# EAGLE schematic WattMeter_v2 (EAGLE 6.5.0)
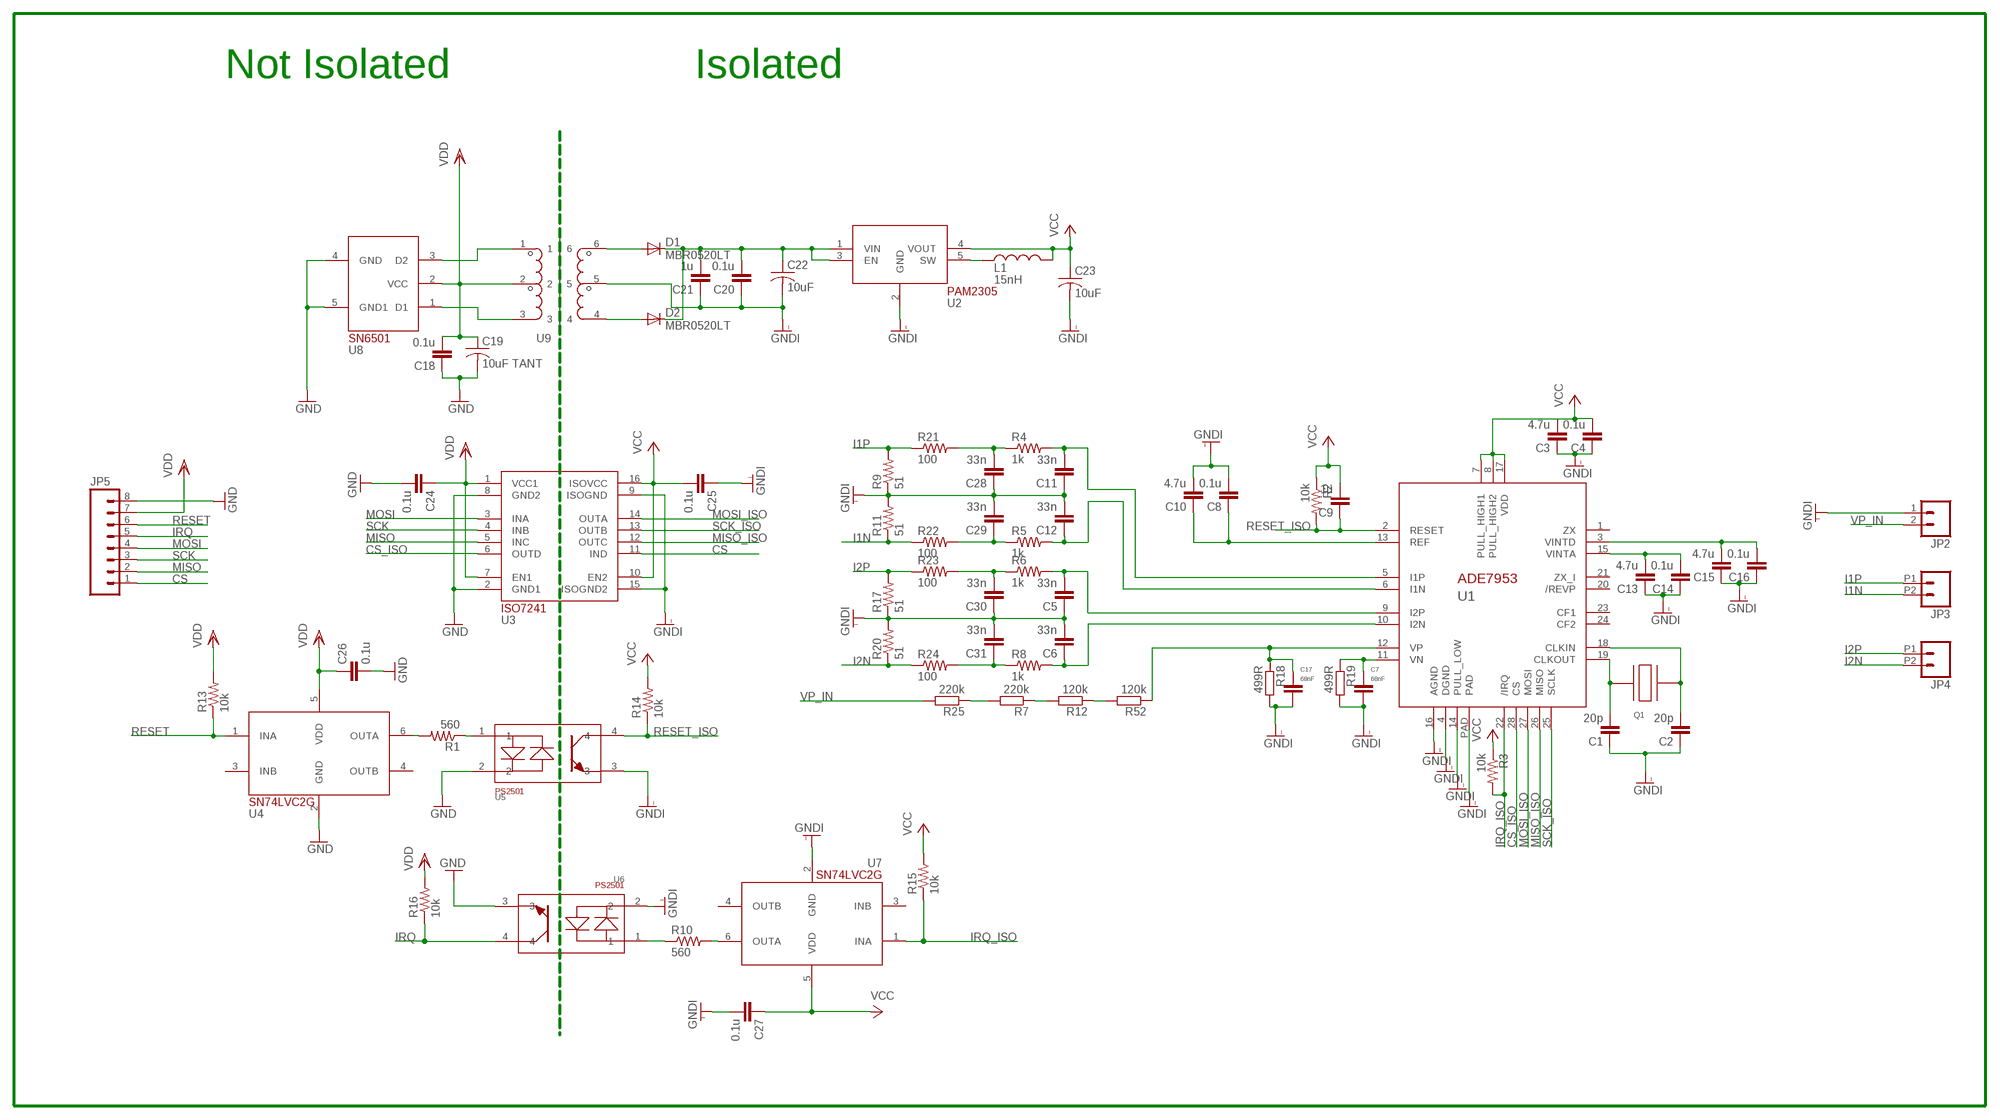
[diagram p0: schematic, sheet 1]

## Parts
C1  20p  0402-CAP  [0402-CAP]
C2  20p  0402-CAP  [0402-CAP]
C3  4.7u  0402-CAP  [0402-CAP]
C4  0.1u  0402-CAP  [0402-CAP]
C5  33n  0402-CAP  [0402-CAP]
C6  33n  0402-CAP  [0402-CAP]
C7  68nF  C-EUC0805K  [C0805K]
C8  0.1u  0402-CAP  [0402-CAP]
C9  1u  0402-CAP  [0402-CAP]
C10  4.7u  0402-CAP  [0402-CAP]
C11  33n  0402-CAP  [0402-CAP]
C12  33n  0402-CAP  [0402-CAP]
C13  4.7u  0402-CAP  [0402-CAP]
C14  0.1u  0402-CAP  [0402-CAP]
C15  4.7u  0402-CAP  [0402-CAP]
C16  0.1u  0402-CAP  [0402-CAP]
C17  68nF  C-EUC0805K  [C0805K]
C18  0.1u  0402-CAP  [0402-CAP]
C19  10uF TANT  C-USC0603  [C0603]
C20  0.1u  0402-CAP  [0402-CAP]
C21  1u  0402-CAP  [0402-CAP]
C22  10uF  C-USC0603  [C0603]
C23  10uF  C-USC0603  [C0603]
C24  0.1u  0402-CAP  [0402-CAP]
C25  0.1u  0402-CAP  [0402-CAP]
C26  0.1u  0402-CAP  [0402-CAP]
C27  0.1u  0402-CAP  [0402-CAP]
C28  33n  0402-CAP  [0402-CAP]
C29  33n  0402-CAP  [0402-CAP]
C30  33n  0402-CAP  [0402-CAP]
C31  33n  0402-CAP  [0402-CAP]
D1  MBR0520LT  [SOD123]
D2  MBR0520LT  [SOD123]
JP2  M025MM  [SCREWTERMINAL-5MM-2]
JP3  M022.54MM_SCREWTERM  [1X02_2.54_SCREWTERM]
JP4  M022.54MM_SCREWTERM  [1X02_2.54_SCREWTERM]
JP5  M08  [1X08_ROUND]
L1  15nH  IND0402  [0402-RES]
Q1  QUARTZ_3.58M_2PIN  [HC-49S]
R1  560  0402-RES  [0402-RES]
R2  10k  0402-RES  [0402-RES]
R3  10k  0402-RES  [0402-RES]
R4  1k  0402-RES  [0402-RES]
R5  1k  0402-RES  [0402-RES]
R6  1k  0402-RES  [0402-RES]
R7  220k  R-EU_R2010  [R2010]
R8  1k  0402-RES  [0402-RES]
R9  51  0402-RES  [0402-RES]
R10  560  0402-RES  [0402-RES]
R11  51  0402-RES  [0402-RES]
R12  120k  R-EU_M1206  [M1206]
R13  10k  0402-RES  [0402-RES]
R14  10k  0402-RES  [0402-RES]
R15  10k  0402-RES  [0402-RES]
R16  10k  0402-RES  [0402-RES]
R17  51  0402-RES  [0402-RES]
R18  499R  R-EU_  [C0805K@1]
R19  499R  R-EU_  [C0805K@1]
R20  51  0402-RES  [0402-RES]
R21  100  0402-RES  [0402-RES]
R22  100  0402-RES  [0402-RES]
R23  100  0402-RES  [0402-RES]
R24  100  0402-RES  [0402-RES]
R25  220k  R-EU_R2010  [R2010]
R52  120k  R-EU_M1206  [M1206]
U1  ADE7953  [28-WFQFN]
U2  PAM2305  [TSOT25]
U3  ISO7241  [16-SOIC]
U4  SN74LVC  [DCKT]
U5  PS2505  [4-SMD]
U6  PS2505  [4-SMD]
U7  SN74LVC  [DCKT]
U8  SN6501  [SOT-23-5]
U9  TRANSFO_3.3  [TRANSFO_3.3]

## Nets
CS: JP5.1 U3.11(IND)
CS_ISO: U1.28(CS) U3.6(OUTD)
GND: C18.1 C19.2 C24.2 C26.2 JP5.8 U3.2(GND1) U3.8(GND2) U4.2(GND) U5.2 U6.3 U8.4(GND) U8.5(GND1)
GNDI: C1.1 C2.1 C3.1 C4.1 C5.1 C6.2 C7.2 C8.2 C10.2 C11.1 C12.2 C13.1 C14.1 C15.1 C16.1 C17.2 C20.1 C21.1 C22.2 C23.2 C25.1 C27.2 C28.1 C29.2 C30.1 C31.2 JP2.1 R9.1 R11.2 R17.1 R18.2 R19.2 R20.2 U1.4(DGND) U1.14(PULL_LOW) U1.16(AGND) U1.PAD U2.2(GND) U3.9(ISOGND) U3.15(ISOGND2) U5.3 U6.2 U7.2(GND) U9.5
I1N: JP3.P2 R11.1 R22.1
I1P: JP3.P1 R9.2 R21.1
I2N: JP4.P2 R20.1 R24.1
I2P: JP4.P1 R17.2 R23.1
IRQ: JP5.5 R16.1 U6.4
IRQ_ISO: R3.2 R15.1 U1.22(/IRQ) U7.1(INA)
MISO: JP5.2 U3.5(INC)
MISO_ISO: U1.26(MISO) U3.12(OUTC)
MOSI: JP5.4 U3.3(INA)
MOSI_ISO: U1.27(MOSI) U3.14(OUTA)
N$1: C1.2 Q1.1 U1.19(CLKOUT)
N$2: C2.2 Q1.2 U1.18(CLKIN)
N$3 [ic]: C7.1 R19.1 U1.11(VN)
N$4: L1.1 U2.5(SW)
N$7: C8.1 C10.1 U1.13(REF)
N$8: C13.2 C14.2 U1.15(VINTA)
N$10: C12.1 R5.2 U1.6(I1N)
N$11: C11.2 R4.2 U1.5(I1P)
N$12: C15.2 C16.2 U1.3(VINTD)
N$14: R12.1 R52.2
N$15: R7.1 R12.2
N$17: R7.2 R25.1
N$18: D1.A U9.6
N$19: C20.2 C21.2 C22.1 D1.C D2.C U2.1(VIN) U2.3(EN)
N$20: D2.A U9.4
N$21: U8.3(D2) U9.1
N$23: U8.1(D1) U9.3
N$24: C28.2 R4.1 R21.2
N$25: R1.1 U5.1
N$26: R1.2 U4.6(OUTA)
N$27: C29.1 R5.1 R22.2
N$28: C6.1 R8.2 U1.10(I2N)
N$29: R10.1 U6.1
N$30: R10.2 U7.6(OUTA)
N$32: C5.2 R6.2 U1.9(I2P)
N$33: C30.2 R6.1 R23.2
N$34: C31.1 R8.1 R24.2
RESET: JP5.6 R13.1 U4.1(INA)
RESET_ISO: C9.1 R2.2 R14.1 U1.2(RESET) U5.4
SCK: JP5.3 U3.4(INB)
SCK_ISO: U1.25(SCLK) U3.13(OUTB)
V2P [ic]: C17.1 R18.1 R52.1 U1.12(VP)
VCC: C3.2 C4.2 C9.2 C23.1 C25.2 C27.1 L1.2 R2.1 R3.1 R14.2 R15.2 U1.7(PULL_HIGH1) U1.8(PULL_HIGH2) U1.17(VDD) U2.4(VOUT) U3.10(EN2) U3.16(ISOVCC) U7.5(VDD)
VDD: C18.2 C19.1 C24.1 C26.1 JP5.7 R13.2 R16.2 U3.1(VCC1) U3.7(EN1) U4.5(VDD) U8.2(VCC) U9.2
VP_IN: JP2.2 R25.2
Unconnected: U1.1(ZX) U1.20(/REVP) U1.21(ZX_I) U1.23(CF1) U1.24(CF2) U4.3(INB) U4.4(OUTB) U7.3(INB) U7.4(OUTB)

## Notes on the sheet
- Not Isolated | Isolated

## Library data of the parts
C1-C6 C8-C16 C18 C20 C21 C24-C31 = Nizanlib:0402-CAP
C7 C17 = resistor:C-EU: CAPACITOR, European symbol
C19 C22 C23 = resistor:C-US: CAPACITOR, American symbol
D1 D2 = diode:MBR0520LT: SCHOTTKY BARRIER RECTIFIER Source: http://onsemi.com .. MBR0520LT1-D.pdf
JP2 = SparkFun-Connectors:M02: Standard 2-pin 0.1" header. Use with - straight break away headers ( PRT-00116) - right angle break away headers (PRT-00553) - swiss pins (PRT-00743) - machine pins (PRT-00117) - female headers (PRT-00115) Molex polarized connector foot print use with: PRT-08233 with associated crimp pins and housings. 2.54_SCREWTERM for use with PRT-10571. 3.5mm Screw Terminal footprints for PRT-08084 5mm Screw Terminal footprints for use with PRT-08432; STOREFRONT_ID: PRT-08432
JP3 JP4 = SparkFun-Connectors:M02: Standard 2-pin 0.1" header. Use with - straight break away headers ( PRT-00116) - right angle break away headers (PRT-00553) - swiss pins (PRT-00743) - machine pins (PRT-00117) - female headers (PRT-00115) Molex polarized connector foot print use with: PRT-08233 with associated crimp pins and housings. 2.54_SCREWTERM for use with PRT-10571. 3.5mm Screw Terminal footprints for PRT-08084 5mm Screw Terminal footprints for use with PRT-08432
JP5 = SparkFun-Connectors:M08: Header 8 Standard 8-pin 0.1" header. Use with straight break away headers (SKU : PRT-00116), right angle break away headers (PRT-00553), swiss pins (PRT-00743), machine pins (PRT-00117), and female headers (PRT-00115).
L1 = Nizanlib:IND0402
Q1 = CalPlug:QUARTZ_3.58M_2PIN; DIGIKEY: http://www.digikey.com/product-detail/en/txc-corporation/9C-3.579545MBBK-T/887-2450-1-ND/4475440
R1-R6 R8-R11 R13-R17 R20-R24 = Nizanlib:0402-RES
R7 R12 R18 R19 R25 R52 = resistor:R-EU_: RESISTOR, European symbol
U1 = CalPlug:ADE7953
U2 = Damien_regulator:PAM2305
U3 = Damien_divers:ISO7241
U4 U7 = Damien_divers:SN74LVC
U5 U6 = Damien_divers:PS2505
U8 = CalPlug:SN6501
U9 = Damien_power:TRANSFO_3.3

## Net classes
1 HIGHVOLTAGE: width 0.254 mm, drill 0.508 mm, clearance 2.413 mm to class 0, clearance 0.152 mm
2 ic: width 0.152 mm, drill 0.305 mm, clearance 0.152 mm to class 0, clearance 2.413 mm to class 1, clearance 0.152 mm